# Altium schematic sheet Sheet3_Buck.SchDoc
size A4; SheetNumber: 3; SheetTotal: 6
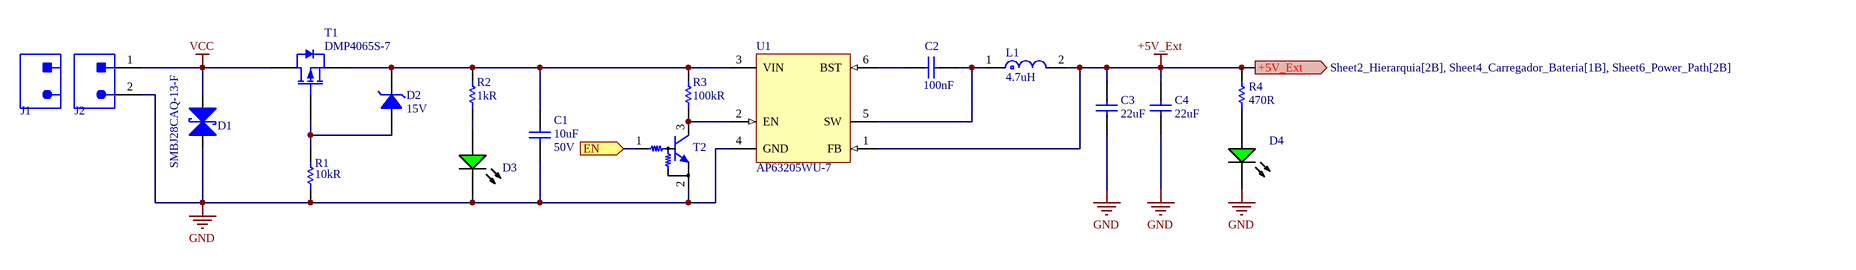
[diagram p0: Sheet3_Buck.SchDoc]

## Parts
?  (no value)  (graphical)
C1  value 10uF  Voltage Rating (DC): 50V  [C-1206]  (hidden comment: CL31A106KBHNNNE)
C2  value 100nF  [C-0805]  (hidden comment: CL21B104KACNNNC)
C3  value 22uF  [C-0805]  (hidden comment: CL21A226MAYNNNE)
C4  value 22uF  [C-0805]  (hidden comment: CL21A226MAYNNNE)
D1  SMBJ28CAQ-13-F  [DO-214AA]
D2  Zener Voltage: 15V  [SOD-123]  (hidden comment: MMSZ5245B-TP)
D3  LTST-C170GKT  [0805-LED-G]  (value not drawn)
D4  LTST-C170GKT  [0805-LED-G]  (value not drawn)
J1  5447861  [5447861]  (value not drawn)
J2  5444262  [5444262]  (value not drawn)
L1  value 4.7uH  [DG6045C]  (hidden comment: 1255AY-4R7M=P3)
R1  value 10kR  [R-0805]  (hidden comment: RC0805FR-0710KL)
R2  value 1kR  [R-0805]  (hidden comment: RC0805FR-071KL)
R3  value 100kR  [R-0805]  (hidden comment: CRGCQ0805F100K)
R4  value 470R  [R-0805]  (hidden comment: CRGCQ0805J470R)
T1  DMP4065S-7  [SOT23-3]
T2  DDTC143ZCA-7-F  [SOT23-3]  (value not drawn)
U1  AP63205WU-7  [TSOT-23-6_A]

## Ports
+5V_Ext (out, see Sheet2_Hierarquia[2B], Sheet4_Carregador_Bateria[1B], Sheet6_Power_Path[2B]), EN (in, see Sheet2_Hierarquia[2B], Sheet6_Power_Path[2C])

## Nets
+5V_Ext: C3.1 C4.1 L1.2 R4.2 U1.1(FB) ; port +5V_Ext
GND: C1.2 C3.2 C4.2 D1.2(Anode) D3.1(K) D4.1(K) J2.2 R1.2 T2.2(GND) U1.4(GND)
VCC: D1.1(Cathode) J2.1 T1.3(D)
EN: T2.1(IN) ; port EN
NetC1_1: C1.1 D2.1(K) R2.1 R3.2 T1.2(S) U1.3(VIN)
NetC2_1: C2.1 L1.1 U1.5(SW)
NetC2_2: C2.2 U1.6(BST)
NetD2_2: D2.2(A) R1.1 T1.1(G)
NetD3_2: D3.2(A) R2.2
NetD4_2: D4.2(A) R4.1
NetR3_1: R3.1 T2.3(OUT) U1.2(EN)

## Notes on the sheet
- Título:
- Endereço
- Rua Aprígio Veloso, 1500 - Bodocongó
  CEP: 58.429-140
  Campina Grande - Paraíba
  Brasil
- Projeto:
- Conta:
- Projetista:
- Arquivo:
- Data:
- Revisor:
- Rev.:
- Pág.:
- de

## Library data of the parts
? = Title Block
C1 = CL31A106KBHNNNE: CAP CER 10UF 50V X5R 1206; Manufacturer: Samsung; Material: Ceramic; Tolerance: 10%; Supplier: Digikey; Supplier Part Number: 1276-2876-1-ND; Manufacturer Part Number: CL31A106KBHNNNE; RoHS: Yes; Category: Ceramic Capacitors; Stock: 1122963; Pricing: 1=0,36, 10=0,212, 50=0,153, 100=0,1346, 500=0,1033, 1000=0,09353, 2000=0,08546, 4000=0,07877, 6000=0,07541, 10000=0,07167, 14000=0,06947, 20000=0,06735, 50000=0,06277, 100000=0,05998 (USD); Mounting Technology: Surface Mount; Case/Package: 1206; Case Code (Metric): 3216; Case Code (Imperial): 1206; Min Operating Temperature: -55°C; Max Operating Temperature: 85°C; Package Quantity: 1; Packaging: Tape and Reel; Voltage Rating: 50V; Dielectric: X5R; Series: CL; Construction: Flat; Length: 3.2mm; Width: 0.063inch; Height: 1.6mm; Thickness: 0.071inch; Depth: 1.6mm; Radiation Hardening: No; Lead Free: Lead Free; RoHS Compliant: Yes; ComponentLink1URL: https://datasheet.ciiva.com/25726/cl31a106kbhnnne-25726404.pdf?src-supplier=Digikey; ComponentLink1Description: https://datasheet.ciiva.com/25726/cl31a106kbhnnne-25726404.pdf?src-supplier=Digikey; ComponentLink2URL: https://datasheet.ciiva.com/15216/getdatasheetpartid-353196-15216238.pdf?src-supplier=Verical; ComponentLink2Description: https://datasheet.ciiva.com/15216/getdatasheetpartid-353196-15216238.pdf?src-supplier=Verical; ComponentLink3URL: https://datasheet.ciiva.com/29201/452492-da-01-en-vs-kondensator-1206-29201107.pdf?src-supplier=Conrad; ComponentLink3Description: https://datasheet.ciiva.com/29201/452492-da-01-en-vs-kondensator-1206-29201107.pdf?src-supplier=Conrad; ComponentLink4URL: https://datasheet.ciiva.com/16437/cl05b104kq5nnnc-16437222.pdf?src-supplier=Future+Electronics; ComponentLink4Description: https://datasheet.ciiva.com/16437/cl05b104kq5nnnc-16437222.pdf?src-supplier=Future+Electronics; Supplier 1: Mouser; Supplier Part Number 1: 187-CL31A106KBHNNNE; Supplier 2: DigiKey; Supplier Part Number 2: 1276-2876-1-ND
C2 = CL21B104KACNNNC: CAP CER 0.1UF 25V X7R 0805; Manufacturer: Samsung; Material: Ceramic; Tolerance: 10%; Supplier: Digikey; Supplier Part Number: 1276-1099-6-ND; Manufacturer Part Number: CL21B104KACNNNC; RoHS: Yes; Category: Ceramic Capacitors; Stock: 257719; Pricing: 1=0,1, 10=0,031, 50=0,0208, 100=0,0178, 500=0,01262, 1000=0,01102 (USD); Mounting Technology: Surface Mount; Case/Package: 0805; Case Code (Metric): 2012; Case Code (Imperial): 0805; Min Operating Temperature: -55°C; Max Operating Temperature: 125°C; Package Quantity: 1; Packaging: Tape and Reel; Voltage Rating: 25V; Dielectric: X7R; Voltage: 25V; Series: CL; Construction: Flat; Length: 2mm; Width: 0.049inch; Height: 0.85mm; Thickness: 0.037inch; Depth: 1.25mm; Radiation Hardening: No; RoHS Compliant: Yes; ComponentLink1URL: https://datasheet.ciiva.com/25801/cl21b104kacnnnc-25801824.pdf?src-supplier=Digikey; ComponentLink1Description: https://datasheet.ciiva.com/25801/cl21b104kacnnnc-25801824.pdf?src-supplier=Digikey; ComponentLink2URL: https://datasheet.ciiva.com/15216/getdatasheetpartid-355204-15216236.pdf?src-supplier=Verical; ComponentLink2Description: https://datasheet.ciiva.com/15216/getdatasheetpartid-355204-15216236.pdf?src-supplier=Verical; Supplier 1: Digikey; Supplier Part Number 1: 1276-1099-1-ND; Supplier 2: Mouser; Supplier Part Number 2: 187-CL21B104KACNNNC; Voltage Rating (DC): 25V
C3 C4 = CL21A226MAYNNNE: CAP CER 22UF 25V X5R 0805; Manufacturer: Samsung; Material: Ceramic; Tolerance: 20%; Supplier: Digikey; Supplier Part Number: 1276-CL21A226MAYNNNECT-ND; Manufacturer Part Number: CL21A226MAYNNNE; RoHS: Yes; Category: Ceramic Capacitors; Stock: 259465; Pricing: 1=0,26, 10=0,147, 50=0,1048, 100=0,0917, 500=0,06924, 1000=0,06226 (USD); Case/Package: 0805; Min Operating Temperature: -55°C; Max Operating Temperature: 85°C; Dielectric: X5R; Voltage Rating: 25V; Voltage Rating (DC): 25V; Height: 1.45mm; RoHS Compliant: Yes; ComponentLink1URL: https://datasheet.octopart.com/CL21A226MAYNNNE-Samsung-Electro-Mechanics-datasheet-149154243.pdf?src-supplier=Future+Electronics; ComponentLink1Description: https://datasheet.octopart.com/CL21A226MAYNNNE-Samsung-Electro-Mechanics-datasheet-149154243.pdf?src-supplier=Future+Electronics; ComponentLink2URL: https://datasheet.octopart.com/CL21A226MAYNNNE-Samsung-datasheet-8326407.pdf?src-supplier=TME; ComponentLink2Description: https://datasheet.octopart.com/CL21A226MAYNNNE-Samsung-datasheet-8326407.pdf?src-supplier=TME; Supplier 1: Mouser; Supplier Part Number 1: 187-CL21A226MAYNNNE; Supplier 2: Digikey; Supplier Part Number 2: 1276-CL21A226MAYNNNECT-ND
D1 = SMBJ28CAQ-13-F: TVS DIODE 28VWM 45.4VC SMB; Manufacturer: Diodes; Number of Bidirectional Channels: 1; Reverse Standoff Voltage: 28V; Min Breakdown Voltage: 31.1V; Clamping Voltage: 45.4V; Peak Pulse Current: 13.2A; Peak Pulse Power: 600W; Power Line Protection: No; Supplier 1: Digi-Key; Manufacturer Part Number: SMBJ28CAQ-13-F; RoHS: Yes; Category: TVS Diodes; Stock 1: 16278; Pricing 1: 1=0,44000, 10=0,37900, 100=0,28310, 500=0,22240, 1000=0,17185 (USD); Mount: Surface Mount; Case/Package: SMB; Min Operating Temperature: -55°C; Max Operating Temperature: 150°C; Resistor Type: Zener; Packaging: Tape and Reel; RoHS Compliant: Yes; ComponentLink1URL: https://www.diodes.com/assets/Datasheets/ds40740.pdf?src-supplier=Digi-Key; ComponentLink1Description: https://www.diodes.com/assets/Datasheets/ds40740.pdf?src-supplier=Digi-Key; Supplier 2: Mouser; Supplier Part Number 2: 621-SMBJ28CAQ-13-F; Supplier Part Number 1: SMBJ28CAQ-13-FDICT-ND
D2 = MMSZ5245B-TP: DIODE ZENER 15V 500MW SOD123; Manufacturer: MCC; Tolerance: 5%; Impedance: 16R; Max Reverse Leakage Current: 100nA; Test Current: 8.5mA; Element Configuration: Single; Supplier 1: Digi-Key; Manufacturer Part Number: MMSZ5245B-TP; RoHS: Yes; Category: Zener Diodes; Stock 1: 330368; Pricing 1: 1=0,22000, 10=0,17700, 100=0,09400, 500=0,06188, 1000=0,04208 (USD); Mount: Surface Mount; Number of Pins: 2; Min Operating Temperature: -55°C; Max Operating Temperature: 150°C; Packaging: Tape and Reel; Package Quantity: 1; Max Power Dissipation: 500mW; Power Dissipation: 500mW; Voltage Tolerance: 5%; Series: -; Lead Free: Lead Free; ComponentLink1URL: https://datasheet.ciiva.com/890/mmsz5221-mmsz5259sod123-890445.pdf?src-supplier=Digi-Key; ComponentLink1Description: https://datasheet.ciiva.com/890/mmsz5221-mmsz5259sod123-890445.pdf?src-supplier=Digi-Key; ComponentLink2URL: https://datasheet.ciiva.com/890/mmsz5221-mmsz5259sod123-890446.pdf?src-supplier=Digi-Key; ComponentLink2Description: https://datasheet.ciiva.com/890/mmsz5221-mmsz5259sod123-890446.pdf?src-supplier=Digi-Key; ComponentLink3URL: https://datasheet.ciiva.com/890/mmsz5221-mmsz5259sod123-890447.pdf?src-supplier=Digi-Key; ComponentLink3Description: https://datasheet.ciiva.com/890/mmsz5221-mmsz5259sod123-890447.pdf?src-supplier=Digi-Key; Supplier 2: Mouser; Supplier 3: Arrow Electronics; Supplier Part Number 1: MMSZ5245B-TPMSCT-ND; Supplier Part Number 2: 833-MMSZ5245B-TP; Supplier Part Number 3: MMSZ5245B-TP
D3 D4 = LTST-C170GKT: LED GREEN CLEAR SMD; Manufacturer: Vishay Lite-On; Lens Color: Colorless; Luminous Intensity: 6mcd; Forward Voltage: 2.1V; Test Current: 10mA; Wavelength: 565nm; Viewing Angle: 130°; Dominant Wavelength: 569nm; Lens Style: Diffused,Colorless,Rectangular; Forward Current: 30mA; Number of LEDs: 1; Power Dissipation: 100mW; Reverse Voltage: 5V; Supplier 1: Digi-Key; Manufacturer Part Number: LTST-C170GKT; RoHS: Yes; Category: LEDs; Stock 1: 753504; Pricing 1: 1=0,30000, 10=0,16000, 100=0,07440, 500=0,06870, 1000=0,05382 (USD); Mount: Surface Mount; Case/Package: 0805; Number of Pins: 2; Color: Green; Case Code (Metric): 2012; Case Code (Imperial): 0805; Min Operating Temperature: -55°C; Max Operating Temperature: 85°C; Package Quantity: 1; Packaging: Tape and Reel; Series: CHIPLED 0805; Lens Transparency: Clear; Illumination Color: Green; Number of Elements: 1; Power Rating: 100mW; Voltage: 5V; Length: 2mm; Width: 1.25mm; Height: 1.1mm; Depth: 1.25mm; Radiation Hardening: No; RoHS Compliant: Yes; Lead Free: Lead Free; ComponentLink1URL: https://datasheet.ciiva.com/2110/ltst-c170gkt-2110128.pdf?src-supplier=Digi-Key; ComponentLink1Description: https://datasheet.ciiva.com/2110/ltst-c170gkt-2110128.pdf?src-supplier=Digi-Key; ComponentLink2URL: https://datasheet.ciiva.com/11773/0900766b80dc0278-11773630.pdf?src-supplier=RSComponents; ComponentLink2Description: https://datasheet.ciiva.com/11773/0900766b80dc0278-11773630.pdf?src-supplier=RSComponents; ComponentLink3URL: https://datasheet.ciiva.com/12400/lite-on-ltst-c170gkt-187191-12400783.pdf?src-supplier=Mouser; ComponentLink3Description: https://datasheet.ciiva.com/12400/lite-on-ltst-c170gkt-187191-12400783.pdf?src-supplier=Mouser; ComponentLink4URL: https://datasheet.ciiva.com/15117/getdatasheetpartid-142079-15117738.pdf?src-supplier=Verical; ComponentLink4Description: https://datasheet.ciiva.com/15117/getdatasheetpartid-142079-15117738.pdf?src-supplier=Verical; ComponentLink5URL: https://datasheet.ciiva.com/25772/ltst-c170gkt-25772881.pdf?src-supplier=Allied+Electronics; ComponentLink5Description: https://datasheet.ciiva.com/25772/ltst-c170gkt-25772881.pdf?src-supplier=Allied+Electronics; ComponentLink6URL: https://datasheet.ciiva.com/16387/ltst-c170gkt-16387357.pdf?src-supplier=Future+Electronics; ComponentLink6Description: https://datasheet.ciiva.com/16387/ltst-c170gkt-16387357.pdf?src-supplier=Future+Electronics; Supplier 2: Mouser; Supplier Part Number 2: 859-LTST-C170GKT; Supplier Part Number 1: 160-1179-1-ND; JLCPCB Part: C125090
J1 = 5447861: TERM BLOCK PLUG 2POS STR 3.81MM; Manufacturer: Phoenix Contact; Current Rating: 8A; Voltage Rating: 160V; Number of Positions: 2; Number of Levels: 1; Connector Type: Screw; Voltage: 300V; Wire Gauge (Max): 30AWG; Wire Gauge (Min): 14AWG; Pitch: 0.15inch; Supplier 1: Digi-Key; Manufacturer Part Number: 5447861; RoHS: Yes; Category: Terminal Blocks; Stock 1: 30203; Pricing 1: 1=2,56000, 10=2,45300, 50=2,38620, 100=2,23000, 250=2,05160, 500=1,89550, 1000=1,80631, 2500=1,77954 (USD); Mount: Free Hanging; Number of Pins: 2; Color: Green; Contact Plating: Tin; Housing Material: Polyamide; Package Quantity: 100; Packaging: Bulk; Number of Positions Per Level: 2; Termination: Screw; Current: 8A; Flammability Rating: UL94 V-0; ComponentLink1URL: https://datasheet.ciiva.com/29706/5447861-29706032.pdf?src-supplier=Digi-Key; ComponentLink1Description: https://datasheet.ciiva.com/29706/5447861-29706032.pdf?src-supplier=Digi-Key; Supplier 2: Mouser; Supplier Part Number 1: 277-11343-ND; Supplier Part Number 2: 651-5447861; JLCPCB Part: *
J2 = 5444262: TERM BLOCK HDR 2POS 90DEG 3.81MM; Manufacturer: Phoenix Contact; Current Rating: 8A; Voltage Rating: 160V; Number of Positions: 2; Number of Levels: 1; Voltage: 300V; Pitch: 0.15inch; Supplier 1: Digi-Key; Manufacturer Part Number: 5444262; RoHS: Yes; Category: Terminal Blocks; Stock 1: 66186; Pricing 1: 1=0,87000, 10=0,83600, 50=0,81320, 100=0,76000, 250=0,69920, 500=0,64600, 1000=0,61560, 2500=0,60648 (USD); Mount: Through Hole; Contact Plating: Tin; Color: Green; Housing Material: Polyamide; Packaging: Bulk; Termination: Solder; Package Quantity: 100; Number of Positions Per Level: 2; Current: 8A; Length: 9.2mm; RoHS Compliant: Yes; Flammability Rating: UL94 V-0; ComponentLink1URL: https://datasheet.ciiva.com/29682/5444262-29682658.pdf?src-supplier=Digi-Key; ComponentLink1Description: https://datasheet.ciiva.com/29682/5444262-29682658.pdf?src-supplier=Digi-Key; Supplier 2: Mouser; Supplier Part Number 2: 651-5444262; Supplier Part Number 1: 277-11313-ND; JLCPCB Part: *
L1 = 1255AY-4R7M=P3: FIXED IND 4.7UH 4A 23 MOHM SMD; Manufacturer: Murata; Core Material: Ferrite; Current Rating: 4.5A; Shielding: Shielded; DC Resistance (DCR): 27.6mR; Test Frequency: 100kHz; Tolerance: 20%; Supplier: Digikey; Supplier Part Number: 490-10812-1-ND; Manufacturer Part Number: 1255AY-4R7M=P3; RoHS: Yes; Category: Fixed Inductors; Stock: 134445; Pricing: 1=0,47, 10=0,368, 25=0,3324, 50=0,3082, 100=0,2855, 250=0,25812, 500=0,2391 (USD); Mounting Technology: Surface Mount; Case/Package: Nonstandard; Min Operating Temperature: -40°C; Max Operating Temperature: 85°C; Packaging: Cut Tape; Max DC Current: 4A; Series: DG6045C; Inductance Tolerance: 20%; Saturation Current: 4.5A; ESR: 27.6mR; Length: 0.248inch; Width: 0.248inch; Height: 4.5mm; Height - Seated (Max): 0.177inch; RoHS Compliant: Yes; ComponentLink1URL: http://search.murata.co.jp/Ceramy/image/img/P02/J(E)TE243B-0037_DG6045C_reference.pdf?src-supplier=Digikey; ComponentLink1Description: http://search.murata.co.jp/Ceramy/image/img/P02/J(E)TE243B-0037_DG6045C_reference.pdf?src-supplier=Digikey; ComponentLink2URL: http://www.toko.co.jp/products/pdf/inductors/dg6045c.pdf?src-supplier=Digikey; ComponentLink2Description: http://www.toko.co.jp/products/pdf/inductors/dg6045c.pdf?src-supplier=Digikey; ComponentLink3URL: http://www.toko.co.jp/products/pdf/inductors/dg6045c.pdf?src-supplier=Avnet; ComponentLink3Description: http://www.toko.co.jp/products/pdf/inductors/dg6045c.pdf?src-supplier=Avnet; Supplier 1: Digikey; Supplier Part Number 1: 490-10812-1-ND; RMS Current (Irms): 4A
R1 = RC0805FR-0710KL: RES 10K OHM 1% 1/8W 0805; Manufacturer: Yageo; Voltage Rating: 150V; Power Rating: 125mW; Temperature Coefficient: 100ppm/°C; Supplier: Digikey; Supplier Part Number: 311-10.0KCRCT-ND; Manufacturer Part Number: RC0805FR-0710KL; RoHS: Yes; Category: Chip SMD Resistors; Stock: 2107948; Pricing: 1=0,1, 10=0,027, 50=0,017, 100=0,0142, 500=0,00976, 1000=0,00844 (USD); Case/Package: 0805; Case Code (Imperial): 0805; Case Code (Metric): 2012; Min Operating Temperature: -55°C; Max Operating Temperature: 155°C; Packaging: Tape and Reel; Package Quantity: 1; Termination: SMD/SMT; Series: RC; Tolerance: 1%; Resistor Type: Thick Film; Number of Terminations: 2; Max Power Dissipation: 125mW; Features: Moisture Resistant; Construction: Rectangular; Resistance Tolerance: 1%; Technology: THICK FILM; Voltage Rating (AC): 150V; Length: 0.079inch; Width: 0.049inch; Height: 0.024inch; Depth: 1.25mm; RoHS Compliant: Yes; Reach SVHC Compliant: Unknown; Military Standard: Not; Lead Free: Lead Free; Supplier 1: Digikey; Supplier Part Number 1: 311-10.0KCRCT-ND; Supplier 2: Mouser; Supplier Part Number 2: 603-RC0805FR-0710KL; Supplier 3: Digikey; Supplier Part Number 3: 541-3976-1-ND
R2 = RC0805FR-071KL: RES 1K OHM 1% 1/8W 0805; Manufacturer: Yageo; Voltage Rating (DC): 150V; Temperature Coefficient: 100ppm/°C; Power Rating: 125mW; Supplier: Digikey; Supplier Part Number: 311-1.00KCRCT-ND; Manufacturer Part Number: RC0805FR-071KL; RoHS: Yes; Category: Chip SMD Resistors; Stock: 2276979; Pricing: 1=0,1, 10=0,025, 50=0,016, 100=0,0133, 500=0,00912, 1000=0,00787 (USD); Case/Package: 0805; Pins: 2; Case Code (Metric): 2012; Case Code (Imperial): 0805; Min Operating Temperature: -55°C; Max Operating Temperature: 155°C; Packaging: Tape and Reel; Termination: SMD/SMT; Package Quantity: 1; Tolerance: 1%; Voltage Rating: 150V; Resistor Type: Thick Film; Series: RC; Number of Terminations: 2; Max Power Dissipation: 125mW; Features: Moisture Resistant; Resistance Tolerance: 1%; Construction: Rectangular; Voltage Rating (AC): 150V; Length: 0.079inch; Width: 0.049inch; Height: 0.024inch; Depth: 1.25mm; Reach SVHC Compliant: No; Lead Free: Lead Free; RoHS Compliant: Yes; Military Standard: Not; ComponentLink1URL: https://datasheet.ciiva.com/2456/pyu-r-int-thick-7-2456975.pdf?src-supplier=Digikey; ComponentLink1Description: https://datasheet.ciiva.com/2456/pyu-r-int-thick-7-2456975.pdf?src-supplier=Digikey; ComponentLink2URL: https://datasheet.ciiva.com/2456/pyu-r-int-thick-7-2456976.pdf?src-supplier=Digikey; ComponentLink2Description: https://datasheet.ciiva.com/2456/pyu-r-int-thick-7-2456976.pdf?src-supplier=Digikey; ComponentLink3URL: https://datasheet.ciiva.com/2456/pyu-r-int-thick-7-2456977.pdf?src-supplier=Digikey; ComponentLink3Description: https://datasheet.ciiva.com/2456/pyu-r-int-thick-7-2456977.pdf?src-supplier=Digikey; ComponentLink4URL: https://datasheet.ciiva.com/16850/rc0805-16850409.pdf?src-supplier=Future+Electronics; ComponentLink4Description: https://datasheet.ciiva.com/16850/rc0805-16850409.pdf?src-supplier=Future+Electronics; ComponentLink5URL: https://datasheet.ciiva.com/46385/444164-46385020.pdf?src-supplier=Element14; ComponentLink5Description: https://datasheet.ciiva.com/46385/444164-46385020.pdf?src-supplier=Element14; ComponentLink6URL: https://datasheet.ciiva.com/7941/1686128-7941719.pdf?src-supplier=Element14; ComponentLink6Description: https://datasheet.ciiva.com/7941/1686128-7941719.pdf?src-supplier=Element14; Supplier 1: Digikey; Supplier Part Number 1: 311-1.00KCRCT-ND; Supplier 2: Mouser; Supplier Part Number 2: 603-RC0805FR-071KL
R3 = CRGCQ0805F100K: RES 100K OHM 1% 1/8W 0805; Manufacturer: TE Connectivity; Interface: I2C,SPI,IrDA,UART,USART; Peripherals: Brown-out Detect/Reset,POR,PWM,WDT,DMA; Memory Format: FLASH; Max Power Dissipation: 125mW; Temperature Coefficient: 100ppm/°C; Core Architecture: ARM; Number of I/Os: 47; Memory Size: 64KB; Oscillator Type: Internal; Voltage Rating: 150V; Supplier: Digikey; Supplier Part Number: A129773CT-ND; Manufacturer Part Number: CRGCQ0805F100K; RoHS: Yes; Category: Chip SMD Resistors; Stock: 241081; Pricing: 1=0,1, 10=0,033, 50=0,0212, 100=0,0177, 500=0,01228, 1000=0,01063 (USD); Case/Package: 0805; Case Code (Imperial): 0805; Case Code (Metric): 2012; Min Operating Temperature: -55°C; Max Operating Temperature: 85°C; Features: Moisture Resistant,Automotive AEC-Q200; Packaging: Cut Tape; Tolerance: 1%; Number of Terminations: 2; Series: CRGCQ; Power Rating: 125mW; Voltage Rating (DC): 150V; Operating Supply Voltage: 150V; Height: 650um; RoHS Compliant: Yes; ComponentLink1URL: https://www.te.com/commerce/DocumentDelivery/DDEController?Action=srchrtrv&DocNm=1773204-3&DocType=DS&DocLang=English&src-supplier=Digikey; ComponentLink1Description: https://www.te.com/commerce/DocumentDelivery/DDEController?Action=srchrtrv&DocNm=1773204-3&DocType=DS&DocLang=English&src-supplier=Digikey; ComponentLink2URL: https://www.te.com/commerce/DocumentDelivery/DDEController?Action=srchrtrv&amp;DocNm=1773204-3&amp;DocType=DS&amp;DocLang=English&src-supplier=Digikey; ComponentLink2Description: https://www.te.com/commerce/DocumentDelivery/DDEController?Action=srchrtrv&amp;DocNm=1773204-3&amp;DocType=DS&amp;DocLang=English&src-supplier=Digikey; ComponentLink3URL: https://4donline.ihs.com/images/VipMasterIC/IC/TYEL/TYEL-S-A0004929575/TYEL-S-A0004929575-1.pdf?hkey=52A5661711E402568146F3353EA87419&src-supplier=Farnell; ComponentLink3Description: https://4donline.ihs.com/images/VipMasterIC/IC/TYEL/TYEL-S-A0004929575/TYEL-S-A0004929575-1.pdf?hkey=52A5661711E402568146F3353EA87419&src-supplier=Farnell; ComponentLink4URL: https://datasheet.octopart.com/CRGCQ0805F100K-TE-Connectivity-datasheet-114679081.pdf?src-supplier=Master+Electronics; ComponentLink4Description: https://datasheet.octopart.com/CRGCQ0805F100K-TE-Connectivity-datasheet-114679081.pdf?src-supplier=Master+Electronics; Supplier 1: Mouser; Supplier Part Number 1: 279-CRGCQ0805F100K; Supplier 2: Digikey; Supplier Part Number 2: A129773CT-ND
R4 = CRGCQ0805J470R: RES 470 OHM 5% 1/8W 0805; Manufacturer: TE Connectivity; Max Power Dissipation: 125mW; Temperature Coefficient: 100ppm/°C; Operating Supply Voltage: 150V; Supplier: Digikey; Supplier Part Number: A130132CT-ND; Manufacturer Part Number: CRGCQ0805J470R; RoHS: Yes; Category: Chip SMD Resistors; Stock: 837845; Pricing: 1=0,1, 10=0,026, 50=0,0162, 100=0,0137, 500=0,00942, 1000=0,00813 (USD); Case/Package: 0805; Case Code (Imperial): 0805; Case Code (Metric): 2012; Min Operating Temperature: -55°C; Max Operating Temperature: 155°C; Features: Moisture Resistant,Automotive AEC-Q200; Series: CRGCQ; Packaging: Cut Tape; Tolerance: 5%; Number of Terminations: 2; Power Rating: 125mW; Voltage Rating: 150V; Voltage Rating (DC): 150V; Height: 650um; Ratings: AEC-Q200; RoHS Compliant: Yes; ComponentLink1URL: http://datasheet.octopart.com/CRGCQ0805J470R-TE-Connectivity-datasheet-114679081.pdf?src-supplier=Digikey; ComponentLink1Description: http://datasheet.octopart.com/CRGCQ0805J470R-TE-Connectivity-datasheet-114679081.pdf?src-supplier=Digikey; ComponentLink2URL: http://datasheet.octopart.com/CRGCQ0805J470R-TE-Connectivity-datasheet-114679081.pdf?src-supplier=Farnell; ComponentLink2Description: http://datasheet.octopart.com/CRGCQ0805J470R-TE-Connectivity-datasheet-114679081.pdf?src-supplier=Farnell; ComponentLink3URL: http://datasheet.octopart.com/CRGCQ0805J470R-TE-Connectivity-datasheet-114679081.pdf?src-supplier=Avnet; ComponentLink3Description: http://datasheet.octopart.com/CRGCQ0805J470R-TE-Connectivity-datasheet-114679081.pdf?src-supplier=Avnet; ComponentLink4URL: http://datasheet.octopart.com/CRGCQ0805J470R-TE-Connectivity-datasheet-114679081.pdf?src-supplier=Mouser; ComponentLink4Description: http://datasheet.octopart.com/CRGCQ0805J470R-TE-Connectivity-datasheet-114679081.pdf?src-supplier=Mouser; ComponentLink5URL: http://datasheet.octopart.com/CRGCQ0805J470R-TE-Connectivity-datasheet-114679081.pdf?src-supplier=Newark; ComponentLink5Description: http://datasheet.octopart.com/CRGCQ0805J470R-TE-Connectivity-datasheet-114679081.pdf?src-supplier=Newark; ComponentLink6URL: http://datasheet.octopart.com/CRGCQ0805J470R-TE-Connectivity-datasheet-114679081.pdf?src-supplier=Onlinecomponents.com; ComponentLink6Description: http://datasheet.octopart.com/CRGCQ0805J470R-TE-Connectivity-datasheet-114679081.pdf?src-supplier=Onlinecomponents.com; ComponentLink7URL: https://datasheet.octopart.com/CRGCQ0805J470R-TE-Connectivity-datasheet-114679081.pdf?src-supplier=Master+Electronics; ComponentLink7Description: https://datasheet.octopart.com/CRGCQ0805J470R-TE-Connectivity-datasheet-114679081.pdf?src-supplier=Master+Electronics; ComponentLink8URL: http://datasheet.octopart.com/CRGCQ0805J470R-TE-Connectivity-datasheet-114679081.pdf?src-supplier=Heilind+Electronics; ComponentLink8Description: http://datasheet.octopart.com/CRGCQ0805J470R-TE-Connectivity-datasheet-114679081.pdf?src-supplier=Heilind+Electronics; ComponentLink9URL: http://datasheet.octopart.com/CRGCQ0805J470R-TE-Connectivity-datasheet-114679081.pdf?src-supplier=Sager+Electronics; ComponentLink9Description: http://datasheet.octopart.com/CRGCQ0805J470R-TE-Connectivity-datasheet-114679081.pdf?src-supplier=Sager+Electronics; ComponentLink10URL: http://datasheet.octopart.com/CRGCQ0805J470R-TE-Connectivity-datasheet-114679081.pdf?src-supplier=Interstate+Connecting+Components; ComponentLink10Description: http://datasheet.octopart.com/CRGCQ0805J470R-TE-Connectivity-datasheet-114679081.pdf?src-supplier=Interstate+Connecting+Components; ComponentLink11URL: http://datasheet.octopart.com/CRGCQ0805J470R-TE-Connectivity-datasheet-114679081.pdf?src-supplier=Electro+Sonic; ComponentLink11Description: http://datasheet.octopart.com/CRGCQ0805J470R-TE-Connectivity-datasheet-114679081.pdf?src-supplier=Electro+Sonic; Supplier 1: Mouser; Supplier Part Number 1: 279-CRGCQ0805J470R; Supplier 2: Digikey; Supplier Part Number 2: A130132CT-ND
T1 = DMP4065S-7: MOSFET P-CH 40V 2.4A SOT23; Manufacturer: Diodes; Number of Channels: 1; Rds On Max: 80mR; Input Capacitance: 587pF; Max Power Dissipation: 720mW; Drain to Source Breakdown Voltage: -40V; Drain to Source Resistance: 64mR; Gate to Source Voltage (Vgs): 20V; Turn-Off Delay Time: 36.3ns; Turn-On Delay Time: 3.6ns; Supplier: Digikey; Supplier Part Number: DMP4065S-7DICT-ND; Manufacturer Part Number: DMP4065S-7; RoHS: Yes; Category: MOSFETs; Stock: 25010; Pricing: 1=0,43, 10=0,302, 100=0,1523, 500=0,135, 1000=0,10506 (USD); Mounting Technology: Surface Mount; Case/Package: SOT-23; Pins: 3; Min Operating Temperature: -55°C; Max Operating Temperature: 150°C; Packaging: Cut Tape; Series: -; Drain to Source Voltage (Vdss): 40V; Continuous Drain Current (ID): 2.4A; Power Dissipation: 720mW; Height: 1.1mm; RoHS Compliant: Yes; ComponentLink1URL: http://www.farnell.com/datasheets/2649034.pdf?src-supplier=Farnell; ComponentLink1Description: http://www.farnell.com/datasheets/2649034.pdf?src-supplier=Farnell; ComponentLink2URL: http://www.mouser.com/ds/2/115/DMP4065S-537770.pdf?src-supplier=Mouser; ComponentLink2Description: http://www.mouser.com/ds/2/115/DMP4065S-537770.pdf?src-supplier=Mouser; ComponentLink3URL: https://www.diodes.com/assets/Datasheets/DMP4065S.pdf?src-supplier=Digikey; ComponentLink3Description: https://www.diodes.com/assets/Datasheets/DMP4065S.pdf?src-supplier=Digikey; ComponentLink4URL: http://diodes.com/datasheets/DMP4065S.pdf?src-supplier=Avnet; ComponentLink4Description: http://diodes.com/datasheets/DMP4065S.pdf?src-supplier=Avnet; ComponentLink5URL: http://www.farnell.com/datasheets/2649034.pdf?src-supplier=Newark; ComponentLink5Description: http://www.farnell.com/datasheets/2649034.pdf?src-supplier=Newark; ComponentLink6URL: http://www.farnell.com/datasheets/2649034.pdf?src-supplier=Element14; ComponentLink6Description: http://www.farnell.com/datasheets/2649034.pdf?src-supplier=Element14; ComponentLink7URL: https://datasheet.octopart.com/DMP4065S-7-Diodes-Inc.-datasheet-129886328.pdf?src-supplier=TME; ComponentLink7Description: https://datasheet.octopart.com/DMP4065S-7-Diodes-Inc.-datasheet-129886328.pdf?src-supplier=TME; Supplier 1: Digikey; Supplier Part Number 1: DMP4065S-7DICT-ND; Supplier 2: Mouser; Supplier Part Number 2: 621-DMP4065S-7
T2 = DDTC143ZCA-7-F: TRANS PREBIAS NPN 200MW SOT23-3; Manufacturer: Diodes; Max Output Current: 100mA; Operating Supply Voltage: 50V; hFE Min: 80; Transition Frequency: 250MHz; Emitter Base Voltage (VEBO): 30V; Element Configuration: Single; Collector-emitter Voltage-Max: 300mV; Manufacturer Part Number: DDTC143ZCA-7-F; RoHS: Yes; Category: BJTs; Stock 1: 1278422; Pricing 1: 1=0,20000, 10=0,18400, 100=0,10000, 500=0,06156, 1000=0,04198 (USD); Mount: Surface Mount; Case/Package: SOT-23-3; Number of Pins: 3; Weight: 0.000282oz; Min Operating Temperature: -55°C; Max Operating Temperature: 150°C; Packaging: Tape and Reel; Package Quantity: 3000; Collector Emitter Voltage (VCEO): 50V; Max Collector Current: 100mA; Max Power Dissipation: 200mW; Collector Emitter Breakdown Voltage: 50V; Max Breakdown Voltage: 50V; Polarity: NPN; Continuous Collector Current: 100mA; Current Rating: 100mA; Voltage Rating (DC): 50V; Series: -; Length: 3.05mm; Width: 1.4mm; Height: 1mm; Radiation Hardening: No; Lead Free: Lead Free; RoHS Compliant: Yes; ComponentLink1URL: http://www.mouser.com/ds/2/115/ds30330-71322.pdf?src-supplier=Mouser; ComponentLink1Description: http://www.mouser.com/ds/2/115/ds30330-71322.pdf?src-supplier=Mouser; ComponentLink2URL: http://www.alliedelec.com/m/d/be0b5f6f3c5081911d08f51c92d34358.pdf?src-supplier=Allied+Electronics; ComponentLink2Description: http://www.alliedelec.com/m/d/be0b5f6f3c5081911d08f51c92d34358.pdf?src-supplier=Allied+Electronics; ComponentLink3URL: http://uk.rs-online.com/webdocs/1321/0900766b81321d3c.pdf?src-supplier=RSComponents; ComponentLink3Description: http://uk.rs-online.com/webdocs/1321/0900766b81321d3c.pdf?src-supplier=RSComponents; ComponentLink4URL: http://components.arrow.com/part/dataview/41508542S9348013N2867?src-supplier=Arrow+Electronics; ComponentLink4Description: http://components.arrow.com/part/dataview/41508542S9348013N2867?src-supplier=Arrow+Electronics; ComponentLink5URL: http://www.diodes.com//datasheets/ds30330.pdf?src-supplier=Avnet; ComponentLink5Description: http://www.diodes.com//datasheets/ds30330.pdf?src-supplier=Avnet; ComponentLink6URL: http://www.diodes.com/_files/datasheets/ds30330.pdf?src-supplier=Future+Electronics; ComponentLink6Description: http://www.diodes.com/_files/datasheets/ds30330.pdf?src-supplier=Future+Electronics; ComponentLink7URL: https://www.diodes.com/assets/Datasheets/ds30330.pdf?src-supplier=Digi-Key; ComponentLink7Description: https://www.diodes.com/assets/Datasheets/ds30330.pdf?src-supplier=Digi-Key; Supplier 1: Digi-Key; Supplier 2: Mouser; Supplier 3: Arrow Electronics; Supplier 4: Digi-Key; Supplier 5: Mouser; Supplier 6: Digi-Key; Supplier 7: Mouser; Supplier Part Number 1: DDTC143ZCA-FDICT-ND; Supplier Part Number 2: 621-DDTC143ZCA-F; Supplier Part Number 3: DDTC143ZCA-7-F; Supplier Part Number 5: 771-PDTC143ZT-/T3; Supplier Part Number 4: 1727-3045-1-ND; Supplier Part Number 6: MUN2233T1GOSCT-ND; Supplier Part Number 7: 863-MUN2233T1G; JLCPCB Part: C508183
U1 = AP63205WU-7: IC REG BUCK 5V 2A TSOT23-6; Manufacturer: Diodes; Max Duty Cycle: 100%; Max Supply Voltage: 32V; Min Supply Voltage: 3.8V; Nominal Supply Current: 22uA; Number of Outputs: 1; Switching Frequency: 1.1MHz; Supplier: Digikey; Supplier Part Number: AP63205WU-7DICT-ND; Manufacturer Part Number: AP63205WU-7; RoHS: Yes; Category: Voltage Regulators - Switching; Stock: 18105; Pricing: 1=1,32, 10=0,831, 25=0,7008, 100=0,5531, 250=0,4808, 500=0,43652, 1000=0,39967 (USD); Min Operating Temperature: -40°C; Max Operating Temperature: 85°C; Output Current: 2A; Output Voltage: 5V; Height: 1mm; ComponentLink1URL: https://www.diodes.com/assets/Datasheets/AP63200-AP63201-AP63203-AP63205.pdf?src-supplier=Digikey; ComponentLink1Description: https://www.diodes.com/assets/Datasheets/AP63200-AP63201-AP63203-AP63205.pdf?src-supplier=Digikey; Supplier 1: Digikey; Supplier Part Number 1: AP63205WU-7DICT-ND; Supplier 2: Mouser; Supplier Part Number 2: 621-AP63205WU-7